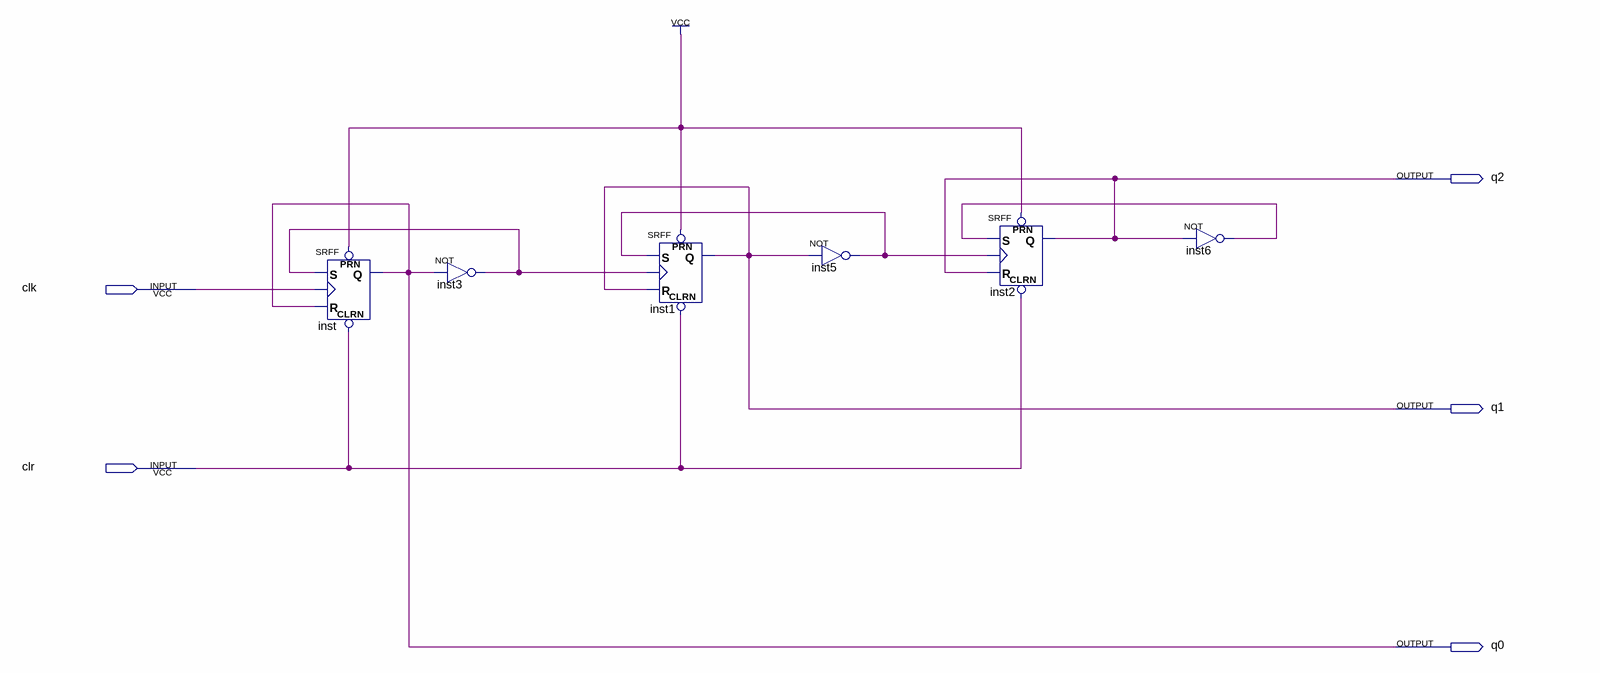
[diagram p0: schematic sheet]
// Quartus schematic 7improve.bdf as structural Verilog: 6 symbols, 5 pins
module \7improve  (
  input  clk,
  input  clr,
  output q2,
  output q1,
  output q0
);

  wire inst3_out, inst5_out, inst6_out;

  SRFF inst (.PRN(1'b1), .CLRN(clr), .S(inst3_out), .R(q0), .CLK(clk), .Q(q0));
  not inst3 (inst3_out, q0);
  SRFF inst1 (.PRN(1'b1), .CLRN(clr), .S(inst5_out), .R(q1), .CLK(inst3_out), .Q(q1));
  not inst5 (inst5_out, q1);
  SRFF inst2 (.PRN(1'b1), .CLRN(clr), .S(inst6_out), .R(q2), .CLK(inst5_out), .Q(q2));
  not inst6 (inst6_out, q2);
endmodule
